# Altium project MooreNANDs.PrjPcb
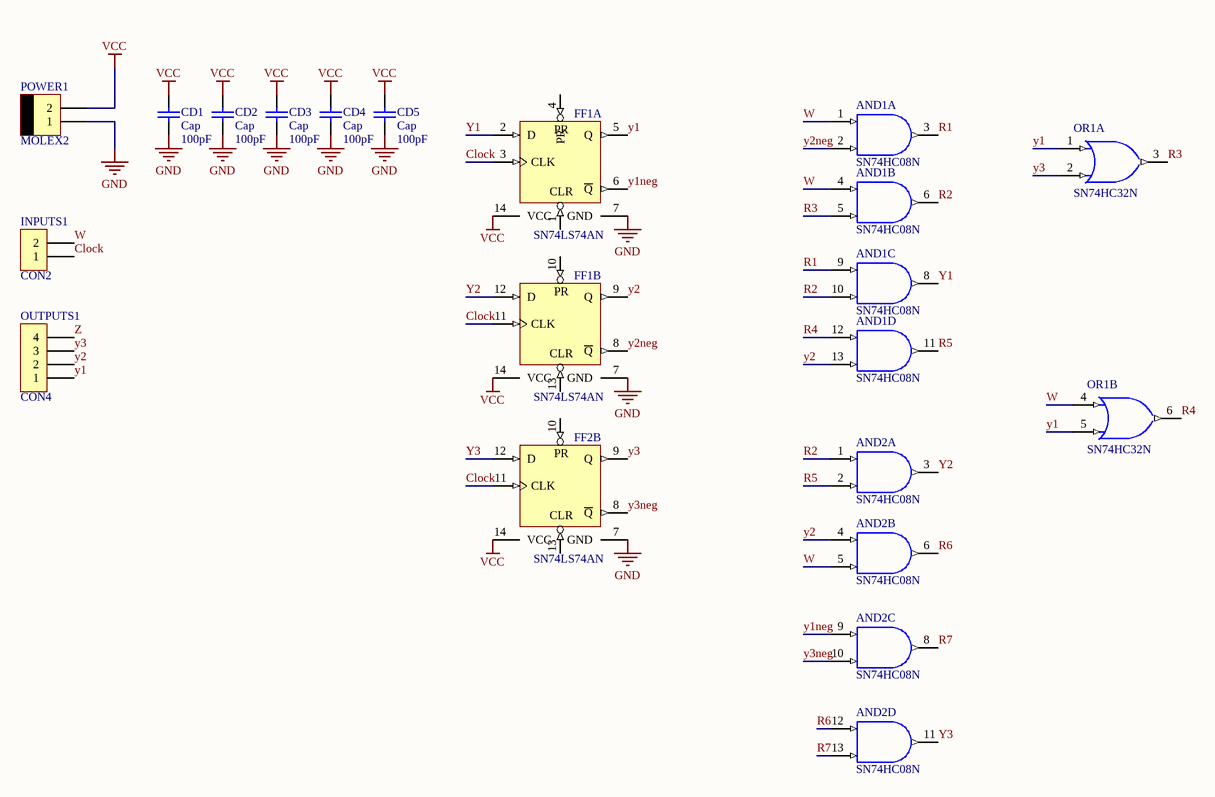
[diagram p0: Esquematico.SchDoc]
1 sheet, 13 parts. Net scope: global (net labels, ports and power ports of the same name join across sheets).
Board file: PCB-NANDs.PcbDoc

## Sheet Esquematico.SchDoc
size A4

### Parts
AND1  SN74HC08N  [N014]  (parts A,B,C,D of 4)
AND2  SN74HC08N  [N014]  (parts A,B,C,D of 4)
CD1  Cap  value 100pF  [RAD-0.3]
CD2  Cap  value 100pF  [RAD-0.3]
CD3  Cap  value 100pF  [RAD-0.3]
CD4  Cap  value 100pF  [RAD-0.3]
CD5  Cap  value 100pF  [RAD-0.3]
FF1  SN74LS74AN  [N014D]  (parts A,B of 2)
FF2  SN74LS74AN  [N014D]  (part B of 2)
INPUTS1  CON2  [SIP2]
OR1  SN74HC32N  [N014]  (parts A,B of 4)
OUTPUTS1  CON4  [SIP4]
POWER1  MOLEX2  [MOLEX2]

### Nets
GND: AND1.7(GND) AND2.7(GND) CD1.1 CD2.1 CD3.1 CD4.1 CD5.1 FF1.7(GND) FF2.7(GND) OR1.7(GND) POWER1.1
VCC: AND1.14(VCC) AND2.14(VCC) CD1.2 CD2.2 CD3.2 CD4.2 CD5.2 FF1.14(VCC) FF2.14(VCC) OR1.14(VCC) POWER1.2
Clock: FF1.3(CLK) FF1.11(CLK) FF2.11(CLK) INPUTS1.1
R1: AND1.3(Y) AND1.9(A)
R2: AND1.6(Y) AND1.10(B) AND2.1(A)
R3: AND1.5(B) OR1.3(Y)
R4: AND1.12(A) OR1.6(Y)
R5: AND1.11(Y) AND2.2(B)
R6: AND2.6(Y) AND2.12(A)
R7: AND2.8(Y) AND2.13(B)
W: AND1.1(A) AND1.4(A) AND2.5(B) INPUTS1.2 OR1.4(A)
y1: AND1.8(Y) FF1.2(D) FF1.5(Q) OR1.1(A) OR1.5(B) OUTPUTS1.1
y1neg: AND2.9(A) FF1.6(~{Q})
y2: AND1.13(B) AND2.3(Y) AND2.4(A) FF1.9(Q) FF1.12(D) OUTPUTS1.2
y2neg: AND1.2(B) FF1.8(~{Q})
y3: AND2.11(Y) FF2.9(Q) FF2.12(D) OR1.2(B) OUTPUTS1.3
y3neg: AND2.10(B) FF2.8(~{Q})
Z: OUTPUTS1.4

Not connected (* = marked no-connect by the designer): FF1 1(CLR) 4(PR) 10(PR) 13(CLR); FF2 10(PR) 13(CLR)

### Library data of the parts
AND1 AND2 = SN74HC08N: Quadruple 2-Input Positive-AND Gate; Published: 8-Jun-2000; LatestRevisionDate: 04-Mar-2005; LatestRevisionNote: Stylized 3D Model Added.; DatasheetVersion: May-1997; PackageVersion: Oct-1995; PackageReference: N014; Publisher: Altium Limited; PackageDescription: DIP; 14 Leads; Row Spacing 7.62 mm; Pitch 2.54 mm; ComponentLink1Description: Manufacturer Link; ComponentLink1URL: http://www.ti.com/; ComponentLink2Description: Datasheet; ComponentLink2URL: http://www-s.ti.com/sc/ds/SN74HC08.pdf
CD1-CD5 = Cap: Capacitor; Published: 8-Jun-2000; LatestRevisionDate: 17-Jul-2002; LatestRevisionNote: Re-released for DXP Platform.; PackageReference: RAD-0.3; Publisher: Altium Limited; PackageDescription: Radial Cap, Thru-Hole; 2 Leads; 0.3 in Pin Spacing
FF1 FF2 = SN74LS74AN: Dual D-Type Positive-Edge-Triggered Flip-Flop with Preset and Clear; Published: 8-Jun-2000; LatestRevisionDate: 04-Mar-2005; LatestRevisionNote: Stylized 3D Model Added.; DatasheetVersion: Mar-1988; PackageVersion: Oct-1995; PackageReference: N014D; Publisher: Altium Limited; PackageDescription: DIP; 14 Leads; Row Spacing 7.62 mm; Pitch 2.54 mm; ComponentLink1Description: Manufacturer Link; ComponentLink1URL: http://www.ti.com/; ComponentLink2Description: Datasheet; ComponentLink2URL: http://www-s.ti.com/sc/ds/sn74ls74a.pdf
OR1 = SN74HC32N: Quadruple 2-Input Positive-OR Gate; Published: 8-Jun-2000; LatestRevisionDate: 04-Mar-2005; LatestRevisionNote: Stylized 3D Model Added.; DatasheetVersion: May-1997; PackageVersion: Oct-1995; PackageReference: N014; Publisher: Altium Limited; PackageDescription: DIP; 14 Leads; Row Spacing 7.62 mm; Pitch 2.54 mm; ComponentLink1Description: Manufacturer Link; ComponentLink1URL: http://www.ti.com/; ComponentLink2Description: Datasheet; ComponentLink2URL: http://www-s.ti.com/sc/ds/sn74hc32.pdf